# Altium project Thermostat_8CH.PrjPCB (part 6 of 6)

## Sheet TH8_EEM_connector.SchDoc: Stabilizer
size 420 x 297 mm; Author: G.Kasprowicz; CompanyName: WUT ISE; DrawnBy: G.Kasprowicz; Organization: WUT ISE; Address1: PW ISE; Address2: Nowowiejska 15/19 00-665 Warsaw; Address3: gkasprow@gmail.com; DocumentNumber: 7; Revision: 1.0; SheetNumber: 7; SheetTotal: 9; ModifiedBy: -; CheckedDate: -; Title2: EEM connector & drivers; DivGrp: WUT ISE; Designer: G.Kasprowicz; ModifiedDate: -; ProjectName: Sensor Box
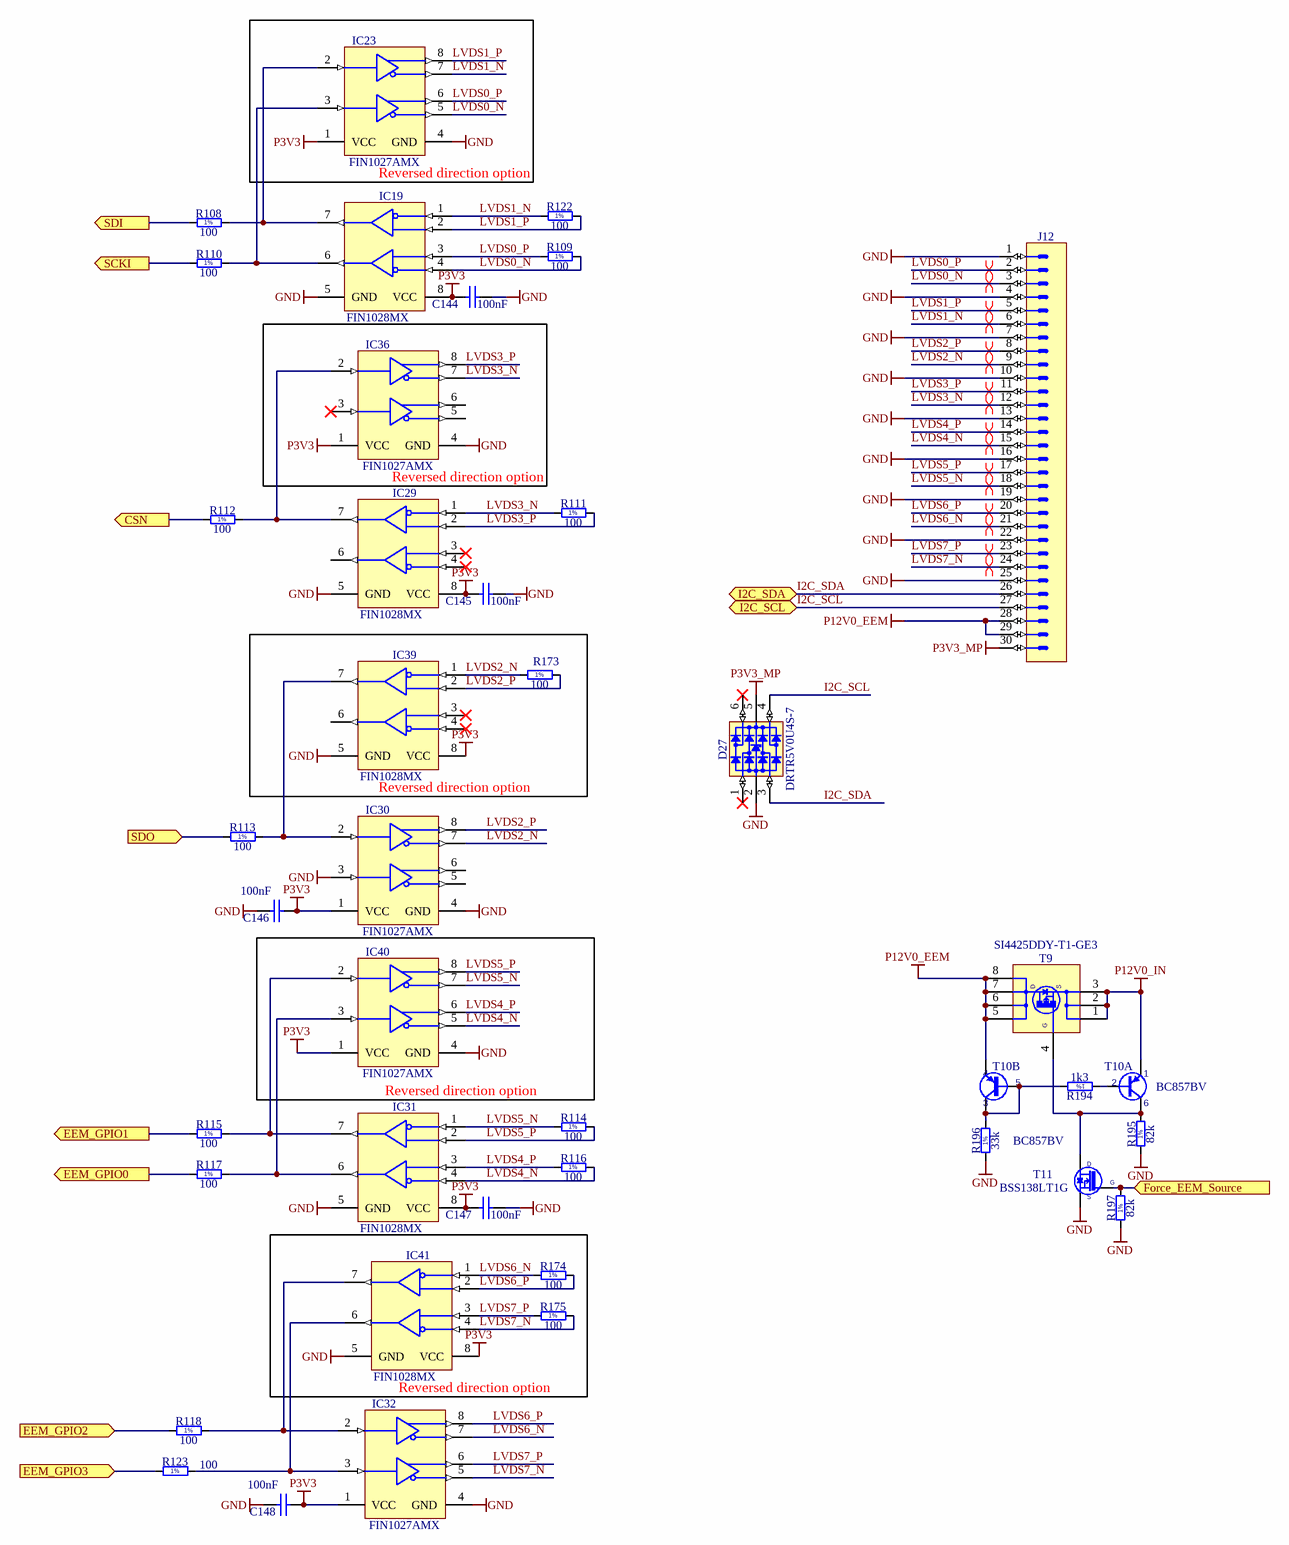
[diagram p7: TH8_EEM_connector.SchDoc]

### Parts
C144  100nF  [CAPC1005X55N]
C145  100nF  [CAPC1005X55N]
C146  100nF  [CAPC1005X55N]
C147  100nF  [CAPC1005X55N]
C148  100nF  [CAPC1005X55N]
D27  DRTR5V0U4S-7  [SOT65P210X110-6N]
IC19  FIN1028MX  [SOIC127P600X175-8N]
IC23  FIN1027AMX  [SOIC127P600X175-8N]
IC29  FIN1028MX  [SOIC127P600X175-8N]
IC30  FIN1027AMX  [SOIC127P600X175-8N]
IC31  FIN1028MX  [SOIC127P600X175-8N]
IC32  FIN1027AMX  [SOIC127P600X175-8N]
IC36  FIN1027AMX  [SOIC127P600X175-8N]
IC39  FIN1028MX  [SOIC127P600X175-8N]
IC40  FIN1027AMX  [SOIC127P600X175-8N]
IC41  FIN1028MX  [SOIC127P600X175-8N]
J12  (no value)  [3M_N2530-6002RB]
R108  100  [RESC1005X40N]
R109  100  [RESC1005X40N]
R110  100  [RESC1005X40N]
R111  100  [RESC1005X40N]
R112  100  [RESC1005X40N]
R113  100  [RESC1005X40N]
R114  100  [RESC1005X40N]
R115  100  [RESC1005X40N]
R116  100  [RESC1005X40N]
R117  100  [RESC1005X40N]
R118  100  [RESC1005X40N]
R122  100  [RESC1005X40N]
R123  100  [RESC1005X40N]
R173  100  [RESC1005X40N]
R174  100  [RESC1005X40N]
R175  100  [RESC1005X40N]
R194  1k3  [RESC1608X55N]
R195  82k  [RESC1608X55N]
R196  33k  [RESC1005X40N]
R197  82k  [RESC1608X55N]
T9  SI4425DDY-T1-GE3  [SOIC127P600X175-8N]
T10  BC857BV  [SOTFL50P160X60-6N]  (parts A,B of 2)
T11  BSS138LT1G  [SOT95P240X110-3N]

### Blocks framed on the sheet
Reversed direction option: IC23
Reversed direction option: IC36
Reversed direction option: IC39 R173
Reversed direction option: IC40
Reversed direction option: IC41 R174 R175

### Ports
CSN (out), EEM_GPIO0 (out), EEM_GPIO1 (out), EEM_GPIO2 (in), EEM_GPIO3 (in), Force_EEM_Source (in), I2C_SCL (bidir), I2C_SDA (bidir), SCKI (out), SDI (out), SDO (in)

### Nets
GND: C144.1 C145.1 C146.1 C147.1 C148.1 D27.2(GND) IC19.5(GND) IC23.4(GND) IC29.5(GND) IC30.3(DIN2RIN-) IC30.4(GND) IC31.5(GND) IC32.4(GND) IC36.4(GND) IC39.5(GND) IC40.4(GND) IC41.5(GND) J12.1 J12.4 J12.7 J12.10 J12.13 J12.16 J12.19 J12.22 J12.25 R195.1 R196.1 R197.1 T11.2(S)
P3V3: C144.2 C145.2 C146.2 C147.2 C148.2 IC19.8(VCC) IC23.1(VCC) IC29.8(VCC) IC30.1(VCC) IC31.8(VCC) IC32.1(VCC) IC36.1(VCC) IC39.8(VCC) IC40.1(VCC) IC41.8(VCC)
P3V3_MP: D27.5(VBUS) J12.30
P12V0_EEM: J12.28 J12.29 T9.5(D) T9.6(D) T9.7(D) T9.8(D) T10.4(E)
P12V0_IN: T9.1(S) T9.2(S) T9.3(S) T10.1(E)
I2C_SCL: D27.4(I/O3) J12.27 ; port I2C_SCL
I2C_SDA: D27.3(I/O2) J12.26 ; port I2C_SDA
LVDS0_N: IC19.4(RIN2-) IC23.5(DOUT-) J12.3 R109.2
LVDS0_P: IC19.3(RIN2+) IC23.6(DOUT+) J12.2 R109.1
LVDS1_N: IC19.1(RIN1-) IC23.7(DOUT-) J12.6 R122.1
LVDS1_P: IC19.2(RIN1+) IC23.8(DOUT+) J12.5 R122.2
LVDS2_N: IC30.7(DOUT-) IC39.1(RIN1-) J12.9 R173.1
LVDS2_P: IC30.8(DOUT+) IC39.2(RIN1+) J12.8 R173.2
LVDS3_N: IC29.1(RIN1-) IC36.7(DOUT-) J12.12 R111.1
LVDS3_P: IC29.2(RIN1+) IC36.8(DOUT+) J12.11 R111.2
LVDS4_N: IC31.4(RIN2-) IC40.5(DOUT-) J12.15 R116.2
LVDS4_P: IC31.3(RIN2+) IC40.6(DOUT+) J12.14 R116.1
LVDS5_N: IC31.1(RIN1-) IC40.7(DOUT-) J12.18 R114.1
LVDS5_P: IC31.2(RIN1+) IC40.8(DOUT+) J12.17 R114.2
LVDS6_N: IC32.7(DOUT-) IC41.1(RIN1-) J12.21 R174.1
LVDS6_P: IC32.8(DOUT+) IC41.2(RIN1+) J12.20 R174.2
LVDS7_N: IC32.5(DOUT-) IC41.4(RIN2-) J12.24 R175.2
LVDS7_P: IC32.6(DOUT+) IC41.3(RIN2+) J12.23 R175.1
NetIC9_73: R112.1 ; port CSN
NetIC9_75: R113.1 ; port SDO
NetIC9_76: R108.1 ; port SDI
NetIC9_114: R197.2 T11.1(G) ; port Force_EEM_Source
NetIC9_117: R110.1 ; port SCKI
NetIC9_118: R117.1 ; port EEM_GPIO0
NetIC9_119: R115.1 ; port EEM_GPIO1
NetIC9_122: R118.1 ; port EEM_GPIO2
NetIC9_123: R123.1 ; port EEM_GPIO3
NetIC19_6: IC19.6(ROUT2) IC23.3(DIN2RIN-) R110.2
NetIC19_7: IC19.7(ROUT1) IC23.2(DIN1) R108.2
NetIC29_7: IC29.7(ROUT1) IC36.2(DIN1) R112.2
NetIC30_2: IC30.2(DIN1) IC39.7(ROUT1) R113.2
NetIC31_6: IC31.6(ROUT2) IC40.3(DIN2RIN-) R117.2
NetIC31_7: IC31.7(ROUT1) IC40.2(DIN1) R115.2
NetIC32_2: IC32.2(DIN1) IC41.7(ROUT1) R118.2
NetIC32_3: IC32.3(DIN2RIN-) IC41.6(ROUT2) R123.2
NetR194_1: R194.1 T10.2(B)
NetR194_2: R194.2 R196.2 T10.3(C) T10.5(B)
NetR195_2: R195.2 T9.4(S) T10.6(C) T11.3(D)

Not connected (* = marked no-connect by the designer): D27 1(I/O1)* 6(I/O4)*; IC29 3(RIN2+)* 4(RIN2-)* 6(ROUT2); IC30 5(DOUT-) 6(DOUT+); IC36 3(DIN2RIN-)* 5(DOUT-) 6(DOUT+); IC39 3(RIN2+)* 4(RIN2-)* 6(ROUT2)

### Layout directives
differential pair: LVDS0_N, LVDS0_P, LVDS1_N, LVDS1_P, LVDS2_N, LVDS2_P, LVDS3_N, LVDS3_P, LVDS4_N, LVDS4_P, LVDS5_N, LVDS5_P, LVDS6_N, LVDS6_P, LVDS7_N, LVDS7_P

### Notes on the sheet
- Project/Equipment
- Document
- Designer
- Drawn by
- Check.by
- Copyright WUT ISE 2020.
  This documentation describes Open Hardware and is licensed under the CERN OHL v.1.2. You may redistribute and modify this documentation under the terms of the CERN OHL v.1.2. (http://ohwr.org/CERNOHL). This documentation is distributed WITHOUT ANY EXPRESS OR IMPLIED WARRANTY, INCLUDING OF MERCHANTABILITY, SATISFACTORY QUALITY AND FITNESS FOR A PARTICULAR PURPOSE. Please see the CERN OHL v.1.2 for applicable conditions.
- Contact
- File
- Last Mod.
- Print Date
- Sheet
- Size
- A3
- of
- Rev
- (in symbol R0402_33K_1%_0.0625W_100PPM) 1%
- (in symbol R0402_100R_1%_0.0625W_100PPM) 1%
- (in symbol R0603_1K3_1%_0.1W_100PPM) 1%
- (in symbol R0603_82K_1%_0.1W_100PPM) 1%
- (in symbol SI4425DDY-T1-GE3) G

### Library data of the parts
C144-C148 = CC0402_100NF_16V_10%_X5R: as C79-C81 on sheet TH8_RMII_Ethernet; Part Number: CC0402_100NF_16V_10%_X5R; Component Kind: Standard; Component Type: Standard; Pin Count: 2; Value: 100nF; Status: None; Manufacturer Part Number: CC0402_100NF_16V_10%_X5R; Case: 0402; Mounted: Yes; Socket: No; SMD: Yes; Sense: No; Manufacturer1 Example: MURATA; Manufacturer1 ComponentHeight: 0.55mm; HelpURL: \\cern.ch\dfs\Applications\Altium\Datasheets\CC0402_X5R_MURATA_GRM.pdf; Author: CERN DEM JLC; CreateDate: 10.12.2013; LatestRevisionDate: 10.12.2013
D27 = D_TVS_DRTR5V0U4S-7: Integrated Quad Ultra-Low Capacitance ESD Protection; Part Description: Integrated Quad Ultra-Low Capacitance ESD (±8kV) Protection; Manufacturer: DIODES; PressFit: No; Bonding: No; Status Comment: Active; Part Number: DRTR5V0U4S-7; Component Kind: Standard; Component Type: Standard; Device: DRTR5V0U4S-7; PackageDescription: SOT363, SC70-6, 0.65mm Pitch; 6 Pin, 1.25mm W X 2.00mm L X 1.10mm H body, IPC Medium Density; Status: Active; Manufacturer Part Number: DRTR5V0U4S-7; Pin Count: 6; Case: SOT363; Mounted: Yes; Socket: No; SMD: Yes; Sense: No; ComponentHeight: 1.1mm; HelpURL: \\cern.ch\dfs\Applications\Altium\Datasheets\PRTR5V0U4Y.pdf; Author: GK; CreateDate: 24.01.2017; LatestRevisionDate: 14.09.2020
IC19 IC29 IC31 IC39 IC41 = IFC_FIN1028: 3.3V LVDS 2-Bit High-Speed Differential Reciever; Manufacturer: ON Semiconductor; PressFit: No; Bonding: No; Part Number: FIN1028MX; Component Kind: Standard; Component Type: Standard; Device: FIN1028MX; PackageDescription: SOIC 8, Pitch 1.27mm - Body 4x5mm, IPC Medium Density; Part Description: 3.3V LVDS 2-Bit High-Speed Differential Reciever; Manufacturer Part Number: FIN1028MX; Pin Count: 8; Case: SOIC8; Mounted: Yes; Socket: No; SMD: Yes; Sense: No; ComponentHeight: 0.8mm; Author: GK; HelpURL: \\cern.ch\dfs\Applications\Altium\Datasheets\FIN1101K8X.pdf; CreateDate: 08/11/2016; LatestRevisionDate: 08/11/2016
IC23 IC30 IC32 IC36 IC40 = IFC_FIN1027A: 3.3V LVDS, 2-Bit, High-Speed, Differential Driver; Manufacturer: ON Semiconductor; PressFit: No; Bonding: No; Part Number: FIN1027AMX; Component Kind: Standard; Component Type: Standard; Device: FIN1027AMX; PackageDescription: SOIC 8, Pitch 1.27mm - Body 4x5mm, IPC Medium Density; Part Description: 3.3V LVDS, 2-Bit, High-Speed, Differential Driver; Manufacturer Part Number: FIN1027AMX; Pin Count: 8; Case: SOIC8; Mounted: Yes; Socket: No; SMD: Yes; Sense: No; ComponentHeight: 0.8mm; Author: GK; HelpURL: \\cern.ch\dfs\Applications\Altium\Datasheets\FIN1101K8X.pdf; CreateDate: 08/11/2016; LatestRevisionDate: 08/11/2016
J12 = 3M_N2530-6002RB: Connector 30 Male; Part Description: 30 Contacts - Straight .100'' x .100'' Low Profile Four-Wall Header, 2500 Series; Manufacturer: 3M; PressFit: No; Part Number: 3M_N2530-6002RB; Component Kind: Standard; Component Type: Standard; Pin Count: 30; Family: Header 30; Mounted: Yes; Socket: No; SMD: No; Sense: No; Status: None; Manufacturer Part Number: N2530-6002RB; ComponentHeight: 10.03mm; HelpURL: \\cern.ch\dfs\Applications\Altium\Datasheets\3M_N2530-6002RB.pdf; Author: CERN DEM JLC; CreateDate: 11.02.2009; LatestRevisionDate: 11.08.2009
R108-R118 R122 R123 R173-R175 = R0402_100R_1%_0.0625W_100PPM: Resistor - 1%; Part Description: General Purpose Thick Film Chip Resistor; Manufacturer: GENERIC; Manufacturer1 Part Number: 232270671001L; TC: ±100ppm/°C; PressFit: No; Part Number: R0402_100R_1%_0.0625W_100PPM; Component Kind: Standard; Component Type: Standard; Pin Count: 2; Value: 100; Status: Not Recommended; Power: 0.0625W; Tolerance: ±1%; Manufacturer Part Number: R0402_100R_1%_0.0625W_100PPM; Case: 0402; Mounted: Yes; Sense: No; Socket: No; SMD: Yes; Manufacturer1 Example: YAGEO PHYCOMP; Manufacturer1 ComponentHeight: 0.4mm; HelpURL: \\cern.ch\dfs\Applications\Altium\Datasheets\R0402_Phycomp_RC0402.pdf; Author: CERN DEM JLC; CreateDate: 03.12.2007; LatestRevisionDate: 17.10.2012
R194 = R0603_1K3_1%_0.1W_100PPM: Resistor - 1%; Part Description: General Purpose Thick Film Chip Resistor; Manufacturer: GENERIC; Manufacturer1 Part Number: NRC06F1301TRF; Power: 0.1W; TC: ±100ppm/°C; PressFit: No; Part Number: R0603_1K3_1%_0.1W_100PPM; Component Kind: Standard; Component Type: Standard; Pin Count: 2; Value: 1k3; Status: Preferred; Tolerance: ±1%; Manufacturer Part Number: R0603_1K3_1%_0.1W_100PPM; Case: 0603; Mounted: Yes; Sense: No; Socket: No; SMD: Yes; Manufacturer1 Example: NIC COMPONENT; Manufacturer1 ComponentHeight: 0.55mm; HelpURL: \\cern.ch\dfs\Applications\Altium\Datasheets\R0603_NIC_NRC.pdf; Author: CERN DEM JLC; CreateDate: 03.12.2007; LatestRevisionDate: 13.03.2008
R195 R197 = R0603_82K_1%_0.1W_100PPM: Resistor - 1%; Part Description: General Purpose Thick Film Chip Resistor; Manufacturer: GENERIC; Manufacturer1 Part Number: NRC06F8202TRF; Power: 0.1W; TC: ±100ppm/°C; Part Number: R0603_82K_1%_0.1W_100PPM; Component Kind: Standard; Component Type: Standard; Pin Count: 2; Value: 82k; Status: Preferred; Tolerance: ±1%; Manufacturer Part Number: R0603_82K_1%_0.1W_100PPM; Case: 0603; Mounted: Yes; Sense: No; Socket: No; SMD: Yes; Manufacturer1 Example: NIC COMPONENT; Manufacturer1 ComponentHeight: 0.55mm; HelpURL: \\cern.ch\dfs\Applications\Altium\Datasheets\R0603_NIC_NRC.pdf; Author: CERN DEM JLC; CreateDate: 03.12.2007; LatestRevisionDate: 13.03.2008
R196 = R0402_33K_1%_0.0625W_100PPM: Resistor - 1%; Part Description: General Purpose Thick Film Chip Resistor; Manufacturer: GENERIC; Manufacturer1 Part Number: 232270673303L; TC: ±100ppm/°C; PressFit: No; Part Number: R0402_33K_1%_0.0625W_100PPM; Component Kind: Standard; Component Type: Standard; Pin Count: 2; Value: 33k; Status: Not Recommended; Power: 0.0625W; Tolerance: ±1%; Manufacturer Part Number: R0402_33K_1%_0.0625W_100PPM; Case: 0402; Mounted: Yes; Sense: No; Socket: No; SMD: Yes; Manufacturer1 Example: YAGEO PHYCOMP; Manufacturer1 ComponentHeight: 0.4mm; HelpURL: \\cern.ch\dfs\Applications\Altium\Datasheets\R0402_Phycomp_RC0402.pdf; Author: CERN DEM JLC; CreateDate: 03.12.2007; LatestRevisionDate: 17.10.2012
T9 = SI4425DDY-T1-GE3: -30V -19.7A P-Channel MOSFET; Manufacturer: VISHAY SILICONIX; PressFit: No; Bonding: No; Part Number: SI4425DDY-T1-GE3; Component Kind: Standard; Component Type: Standard; Device: SI4425DDY-T1-GE3; PackageDescription: SOIC 8, Pitch 1.27mm - Body 4x5mm, IPC Medium Density; Part Description: -30V -19.7A P-Channel MOSFET; Manufacturer Part Number: SI4425DDY-T1-GE3; Pin Count: 8; Case: SOIC8; Mounted: Yes; Socket: No; SMD: Yes; Sense: No; ComponentHeight: 1.75mm; HelpURL: \\cern.ch\dfs\Applications\Altium\Datasheets\SI4425DDY-T1-GE3.pdf; Author: CERN DEM MR; CreateDate: 05/10/2016; LatestRevisionDate: 05/10/2016
T10 = BC857BV: 45V, 100mA PNP General Purpose Double Transistor; Part Description: -45V -100mA PNP General Purpose Double Transistor; Manufacturer: NXP SEMICONDUCTORS; PressFit: No; Bonding: No; Part Number: BC857BV; Component Kind: Standard; Component Type: Standard; Device: BC857BV; PackageDescription: SOTFL (SOT666), 0.50mm, Pitch; 6 Pin, 1.20mm W X 1.60mm L X 0.60mm H Body, IPC Medium Density; Manufacturer Part Number: BC857BV; Pin Count: 6; Case: SOT666; Mounted: Yes; Socket: No; SMD: Yes; Sense: No; ComponentHeight: 0.6mm; HelpURL: \\cern.ch\dfs\Applications\Altium\Datasheets\BC857BV.pdf; Author: CERN DEM JLC; CreateDate: 01/12/2011; LatestRevisionDate: 01/12/2011
T11 = BSS138LT1G: N-CHANNEL MOSFET WITH DIODE; Part Description: 50V 200mA N-Channel Enhancement Mode Field-Effect Transistor; Manufacturer: ON SEMICONDUCTOR; PressFit: No; Bonding: No; Part Number: BSS138LT1G; Component Kind: Standard; Component Type: Standard; Device: BSS138LT1G; PackageDescription: SOT23 3-Leads, Pitch 0.95mm - Body 1.4x3mm, IPC Medium Density; Manufacturer Part Number: BSS138LT1G; Pin Count: 3; Case: SOT23-3; Mounted: Yes; Socket: No; SMD: Yes; Sense: No; ComponentHeight: 1.11mm; HelpURL: \\cern.ch\dfs\Applications\Altium\Datasheets\BSS138LT1G.pdf; Author: CERN DEM JLC; CreateDate: 23.03.2009; LatestRevisionDate: 23.03.2009

## Sheet TH8_Breakout.SchDoc: Thermostat 8CH
size 420 x 297 mm; DocumentNumber: 6; SheetNumber: 6; SheetTotal: 9; ModifiedBy: -; CheckedDate: -; Title2: Breakout board; DivGrp: WUT ISE; Designer: G.Kasprowicz
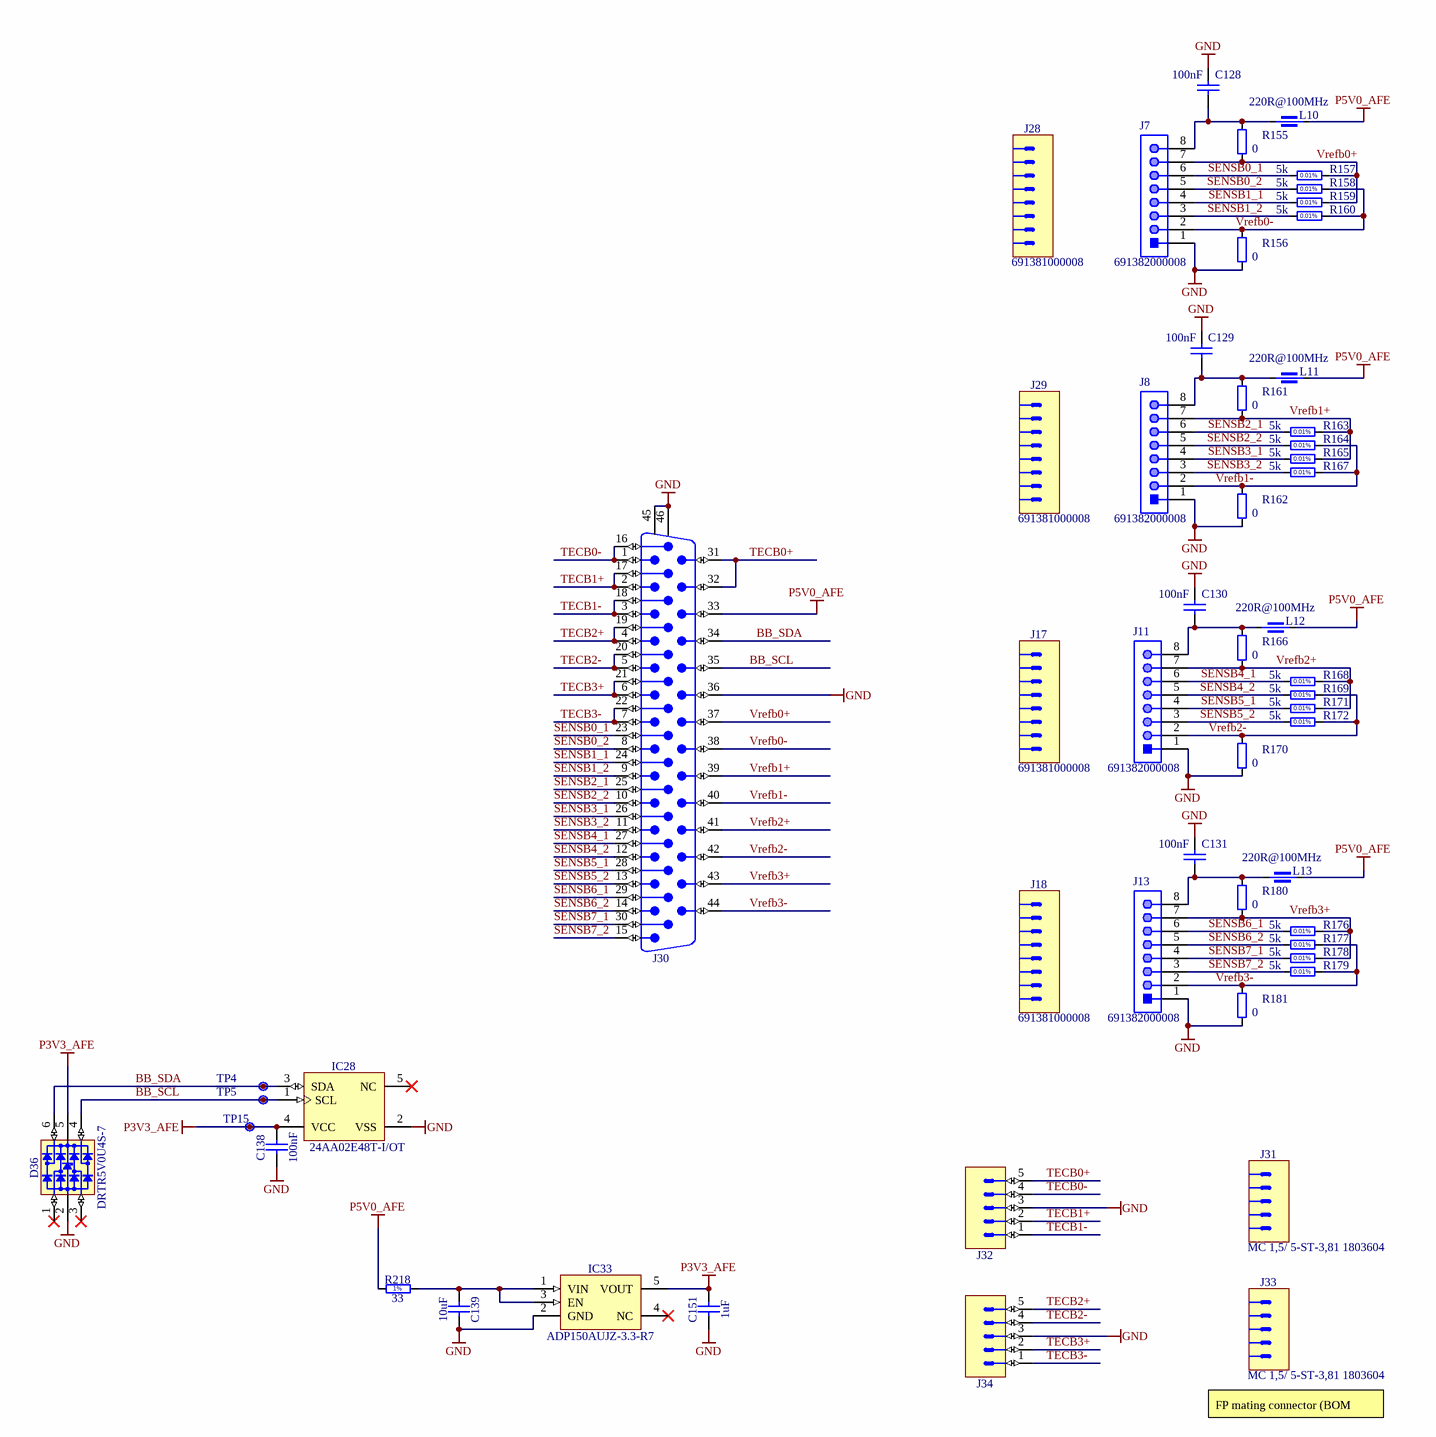
[diagram p8: TH8_Breakout.SchDoc]

### Parts
C128  100nF  [CAPC1005X55N]
C129  100nF  [CAPC1005X55N]
C130  100nF  [CAPC1005X55N]
C131  100nF  [CAPC1005X55N]
C138  100nF  [CAPC1005X55N]
C139  10uF  [CAPC2012X135N]
C151  1uF  [CAPC1608X87N]
D36  DRTR5V0U4S-7  [SOT65P210X110-6N]
IC28  24AA02E48T-I/OT  [SOT95P280X145-5N]
IC33  ADP150AUJZ-3.3-R7  [SOT95P280X90-5N]
J7  691382000008  [691382000008]
J8  691382000008  [691382000008]
J11  691382000008  [691382000008]
J13  691382000008  [691382000008]
J17  691381000008  [WURTH_691381000008]
J18  691381000008  [WURTH_691381000008]
J28  691381000008  [WURTH_691381000008]
J29  691381000008  [WURTH_691381000008]
J30  D-Sub  [AMPHENOL_10090926-P444XLF]  (value not drawn)
J31  Manufacturer Part Number: MC 1,5/ 5-ST-3,81 1803604  [PHOENIX_1803604]
J32  (no value)  [PHOENIX_1803455]
J33  Manufacturer Part Number: MC 1,5/ 5-ST-3,81 1803604  [PHOENIX_1803604]
J34  (no value)  [PHOENIX_1803455]
L10  220R@100MHz  [INDC1005X55N]
L11  220R@100MHz  [INDC1005X55N]
L12  220R@100MHz  [INDC1005X55N]
L13  220R@100MHz  [INDC1005X55N]
R155  0  [RESC1608X55N]
R156  0  [RESC1608X55N]
R157  5k  [RESC2013X64N]
R158  5k  [RESC2013X64N]
R159  5k  [RESC2013X64N]
R160  5k  [RESC2013X64N]
R161  0  [RESC1608X55N]
R162  0  [RESC1608X55N]
R163  5k  [RESC2013X64N]
R164  5k  [RESC2013X64N]
R165  5k  [RESC2013X64N]
R166  0  [RESC1608X55N]
R167  5k  [RESC2013X64N]
R168  5k  [RESC2013X64N]
R169  5k  [RESC2013X64N]
R170  0  [RESC1608X55N]
R171  5k  [RESC2013X64N]
R172  5k  [RESC2013X64N]
R176  5k  [RESC2013X64N]
R177  5k  [RESC2013X64N]
R178  5k  [RESC2013X64N]
R179  5k  [RESC2013X64N]
R180  0  [RESC1608X55N]
R181  0  [RESC1608X55N]
R218  33  [RESC1005X40N]
TP4  Test Point  [TPS127]  (value not drawn)
TP5  Test Point  [TPS127]  (value not drawn)
TP15  Test Point  [TPS127]  (value not drawn)

### Nets
GND: C128.1 C129.1 C130.1 C131.1 C138.1 C139.2 C151.1 D36.2(GND) IC28.2(VSS) IC33.2(GND) J7.1 J8.1 J11.1 J13.1 J30.36 J30.45 J30.46 J32.3 J34.3 R156.1 R162.1 R170.1 R181.1
P3V3_AFE: C138.2 C151.2 D36.5(VBUS) IC28.4(VCC) IC33.5(VOUT) TP15.1
P5V0_AFE: J30.33 L10.2 L11.2 L12.2 L13.2 R218.1
BB_SCL: D36.4(I/O3) IC28.1(SCL) J30.35 TP5.1
BB_SDA: D36.6(I/O4) IC28.3(SDA) J30.34 TP4.1
SENSB0_1: J7.6 J30.23 R157.1
SENSB0_2: J7.5 J30.8 R158.1
SENSB1_1: J7.4 J30.24 R159.1
SENSB1_2: J7.3 J30.9 R160.1
SENSB2_1: J8.6 J30.25 R163.1
SENSB2_2: J8.5 J30.10 R164.1
SENSB3_1: J8.4 J30.26 R165.1
SENSB3_2: J8.3 J30.11 R167.1
SENSB4_1: J11.6 J30.27 R168.1
SENSB4_2: J11.5 J30.12 R169.1
SENSB5_1: J11.4 J30.28 R171.1
SENSB5_2: J11.3 J30.13 R172.1
SENSB6_1: J13.6 J30.29 R176.1
SENSB6_2: J13.5 J30.14 R177.1
SENSB7_1: J13.4 J30.30 R178.1
SENSB7_2: J13.3 J30.15 R179.1
TECB0+: J30.31 J30.32 J32.5
TECB0-: J30.1 J30.16 J32.4
TECB1+: J30.2 J30.17 J32.2
TECB1-: J30.3 J30.18 J32.1
TECB2+: J30.4 J30.19 J34.5
TECB2-: J30.5 J30.20 J34.4
TECB3+: J30.6 J30.21 J34.2
TECB3-: J30.7 J30.22 J34.1
Vrefb0+: J7.7 J30.37 R155.1 R157.2 R159.2
Vrefb0-: J7.2 J30.38 R156.2 R158.2 R160.2
Vrefb1+: J8.7 J30.39 R161.1 R163.2 R165.2
Vrefb1-: J8.2 J30.40 R162.2 R164.2 R167.2
Vrefb2+: J11.7 J30.41 R166.1 R168.2 R171.2
Vrefb2-: J11.2 J30.42 R169.2 R170.2 R172.2
Vrefb3+: J13.7 J30.43 R176.2 R178.2 R180.1
Vrefb3-: J13.2 J30.44 R177.2 R179.2 R181.2
NetC128_2: C128.2 J7.8 L10.1 R155.2
NetC129_2: C129.2 J8.8 L11.1 R161.2
NetC130_2: C130.2 J11.8 L12.1 R166.2
NetC131_2: C131.2 J13.8 L13.1 R180.2
NetC139_1: C139.1 IC33.1(VIN) IC33.3(EN) R218.2

Not connected (* = marked no-connect by the designer): D36 1(I/O1)* 3(I/O2)*; IC28 5(NC)*; IC33 4(NC)*

### Notes on the sheet
- FP mating connector (BOM only)
- Project/Equipment
- Document
- Designer
- Drawn by
- Check.by
- Copyright WUT ISE 2020.
  This documentation describes Open Hardware and is licensed under the CERN OHL v.1.2. You may redistribute and modify this documentation under the terms of the CERN OHL v.1.2. (http://ohwr.org/CERNOHL). This documentation is distributed WITHOUT ANY EXPRESS OR IMPLIED WARRANTY, INCLUDING OF MERCHANTABILITY, SATISFACTORY QUALITY AND FITNESS FOR A PARTICULAR PURPOSE. Please see the CERN OHL v.1.2 for applicable conditions.
- Contact
- File
- Last Mod.
- Print Date
- Sheet
- Size
- A3
- of
- Rev
- (in symbol R0402_33R_1%_0.0625W_100PPM) 1%
- (in symbol R0805_5K_0.01%_0.2W_0.2PPM_VISHAY_VSMP) 0.01%

### Library data of the parts
C128-C131 C138 = CC0402_100NF_16V_10%_X5R: as C79-C81 on sheet TH8_RMII_Ethernet; Part Number: CC0402_100NF_16V_10%_X5R; Component Kind: Standard; Component Type: Standard; Pin Count: 2; Value: 100nF; Status: None; Manufacturer Part Number: CC0402_100NF_16V_10%_X5R; Case: 0402; Mounted: Yes; Socket: No; SMD: Yes; Sense: No; Manufacturer1 Example: MURATA; Manufacturer1 ComponentHeight: 0.55mm; HelpURL: \\cern.ch\dfs\Applications\Altium\Datasheets\CC0402_X5R_MURATA_GRM.pdf; Author: CERN DEM JLC; CreateDate: 10.12.2013; LatestRevisionDate: 10.12.2013
C139 = CC0805_10UF_16V_10%_X5R: Non-polarised capacitor; Part Description: SMD Multilayer Chip Ceramic Capacitor; Manufacturer: GENERIC; Manufacturer1 Part Number: C0805C106K4PAC; Voltage: 16V; TC: X5R; Tolerance: ±10%; Part Number: CC0805_10UF_16V_10%_X5R; Component Kind: Standard; Component Type: Standard; Pin Count: 2; Value: 10uF; Status: Preferred; Manufacturer Part Number: CC0805_10UF_16V_10%_X5R; Case: 0805; Mounted: Yes; Socket: No; SMD: Yes; Manufacturer1 Example: KEMET; Manufacturer1 ComponentHeight: 1.4mm; HelpURL: \\cern.ch\dfs\Applications\Altium\Datasheets\CC1206_X5R_KEMET.pdf; Author: CERN DEM JLC; CreateDate: 03.12.2007; LatestRevisionDate: 03.12.2007; Sense: No
C151 = CC0603_1UF_25V_10%_X7R: Non-polarised capacitor; Part Description: SMD Multilayer Chip Ceramic Capacitor; Manufacturer: GENERIC; Manufacturer1 Part Number: GRM188R71E105KA12D; Voltage: 25V; TC: X7R; Tolerance: ±10%; Part Number: CC0603_1UF_25V_10%_X7R; Component Kind: Standard; Component Type: Standard; Pin Count: 2; Value: 1uF; Status: None; Manufacturer Part Number: CC0603_1UF_25V_10%_X7R; Case: 0603; Mounted: Yes; Socket: No; SMD: Yes; Sense: No; Manufacturer1 Example: MURATA; Manufacturer1 ComponentHeight: 0.9mm; HelpURL: \\cern.ch\dfs\Applications\Altium\Datasheets\CC0603_X7R_MURATA.pdf; Author: CERN DEM JLC; CreateDate: 18/01/2011; LatestRevisionDate: 18/01/2011
D36 = D_TVS_DRTR5V0U4S-7: as D27 on sheet TH8_EEM_connector; Part Number: DRTR5V0U4S-7; Component Kind: Standard; Component Type: Standard; Device: DRTR5V0U4S-7; PackageDescription: SOT363, SC70-6, 0.65mm Pitch; 6 Pin, 1.25mm W X 2.00mm L X 1.10mm H body, IPC Medium Density; Status: Active; Manufacturer Part Number: DRTR5V0U4S-7; Pin Count: 6; Case: SOT363; Mounted: Yes; Socket: No; SMD: Yes; Sense: No; ComponentHeight: 1.1mm; HelpURL: \\cern.ch\dfs\Applications\Altium\Datasheets\PRTR5V0U4Y.pdf; Author: GK; CreateDate: 24.01.2017; LatestRevisionDate: 14.09.2020
IC28 = 24AA02E48T-I/OT: 1.7V-5.5V, 2K I2C Serial EEPROM With EUI-48 Node Identity; Manufacturer: MICROCHIP TECHNOLOGY; PressFit: No; Bonding: No; Part Number: 24AA02E48T-I/OT; Component Kind: Standard; Component Type: Standard; Device: 24AA02E48T-I/OT; PackageDescription: SOT, 0.95mm pitch; 5 pin, 1.60mm W X 2.90mm L X 1.45mm H body, IPC Medium Density; Part Description: 1.7V-5.5V, 2K I2C Serial EEPROM With EUI-48 Node Identity; Manufacturer Part Number: 24AA02E48T-I/OT; Pin Count: 5; Case: SOT23-5; Mounted: Yes; Socket: No; SMD: Yes; Sense: No; ComponentHeight: 1.45mm; HelpURL: \\cern.ch\dfs\Applications\Altium\Datasheets\24AA02E48T-I-OT.pdf; Author: CERN DEM MR; CreateDate: 31.03.2016; LatestRevisionDate: 31.03.2016
IC33 = ADP150AUJZ-3.3-R7: Ultralow Noise, 150 mA CMOS Linear Regulator; Part Description: 3.3V, 150mA, Ultralow Noise, CMOS Linear Regulator; Manufacturer: ANALOG DEVICES; PressFit: No; Bonding: No; Part Number: ADP150AUJZ-3.3-R7; Component Kind: Standard; Component Type: Standard; Device: ADP150AUJZ-3.3-R7; PackageDescription: SOT23, 0.95mm pitch; 5 pin, 1.75mm W X 3.00mm L, IPC Medium Density; Manufacturer Part Number: ADP150AUJZ-3.3-R7; Pin Count: 5; Case: SOT23; Mounted: Yes; Socket: No; SMD: Yes; Sense: No; ComponentHeight: 0.9mm; HelpURL: \\cern.ch\dfs\Applications\Altium\Datasheets\ADP150AUJZ-3.3-R7.pdf; Author: CERN DEM JLC; CreateDate: 27/09/2011; LatestRevisionDate: 19/06/2014
J7 J8 J11 J13 = 691382000008: WR-TBL Serie 382 Vertical PCB Header, Pluggable, pitch 2.5mm, 8p; Compliance: RoHS; Modularity: No; Pin Number: 8; Rated Current [UL]: 12A; Working Voltage [UL]: 300VAC; ComponentLink1Description: Manufacturer; ComponentLink1URL: http://www.we-online.de; ComponentLink2URL: https://katalog.we-online.de/em/datasheet/691382000008.pdf; ComponentLink2Description: Datasheet; Mounting Technology: THT; Part Number: 691382000008; Packaging: Box; Operating Temperature: -40 to +105degC; PCB/Cable/Panel: PCB; Pitch: 2.5mm; Published Date: October 2019; Type: Vertical; Publisher: Wurth Elektronik; Application: Pluggable
J17 J18 J28 J29 = CON_TB_WURTH_691381000008: Phoenix Contact 2.5 pitch terminal plug, 8 ways; Manufacturer: WURTH; Manufacturer Part Number: 691381000008
J30 = AMPHENOL_10090926-P444XLF: Connector D-sub 44 Male; Part Description: Right Angle High Density D-sub 44 Male Contacts with Harpoons + UNC 4-40 Clinchnuts + Electrical Continuity; PressFit: No; Part Number: AMPHENOL_10090926-P444XLF; Component Kind: Standard; Component Type: Standard; Pin Count: 46; Family: D-Sub; Mounted: Yes; Socket: No; SMD: No; Sense: No; Status: None; Manufacturer: AMPHENOL; Manufacturer Part Number: 10090926-P444XLF; ComponentHeight: 12.8mm; HelpURL: \\cern.ch\dfs\Applications\Altium\Datasheets\AMPHENOL_10090926-P444XLF.pdf; Author: CERN DEM BC; CreateDate: 22.10.2020; LatestRevisionDate: 22.10.2020
J31 J33 = PHOENIX_1803604: Phoenix Contact 3.81 pitch terminal plug, 5 ways; Mates with: PHOENIX_1803303; Manufacturer: Phoenix Contact
J32 J34 = PHOENIX_1803455: Connector 5 Male; Part Description: 8A 160 V, Pitch: 3.81mm, 5 Positions Header; Manufacturer: PHOENIX CONTACT; Manufacturer Part Number: 1803455 (MCV 1,5/ 5-G-3,81); PressFit: No; Part Number: PHOENIX_1803455; Component Kind: Standard; Component Type: Standard; Pin Count: 5; Mounted: Yes; Socket: No; SMD: No; Sense: No; Status: None; ComponentHeight: 9.2mm; HelpURL: \\cern.ch\dfs\Applications\Altium\Datasheets\PHOENIX_1803455.pdf; Author: CERN DEM JLC; CreateDate: 04.11.2013; LatestRevisionDate: 04.11.2013
L10-L13 = IND0402_MURATA_BLM15HB221SN1: Part Description: SMD EMIFIL Suppression Chip Ferrite Bead; Manufacturer: MURATA; Power: 250mA; Resistance: 1R; Tolerance: ±25%; Part Number: IND0402_MURATA_BLM15HB221SN1; Component Kind: Standard; Component Type: Standard; Pin Count: 2; Value: 220R@100MHz; Status: None; Manufacturer Part Number: BLM15HB221SN1; Case: 0402; Mounted: Yes; Socket: No; SMD: Yes; Sense: No; ComponentHeight: 0.55mm; HelpURL: \\cern.ch\dfs\Applications\Altium\Datasheets\IND0402_MURATA_BLM15H.pdf; Author: CERN DEM JLC; CreateDate: 23.06.2009; LatestRevisionDate: 25.10.2018
R155 R156 R161 R162 R166 R170 R180 R181 = R0603_0R_JUMPER: Resistor; Part Description: 1A (0.05R Max DC Resistance) Zero Ohm Jumper; Manufacturer: GENERIC; Manufacturer1 Part Number: NRC06Z0; PressFit: No; Part Number: R0603_0R_JUMPER; Component Kind: Standard; Component Type: Standard; Pin Count: 2; Value: 0; Status: Preferred; Manufacturer Part Number: R0603_0R_JUMPER; Case: 0603; Mounted: Yes; Sense: No; Socket: No; SMD: Yes; Manufacturer1 Example: NIC COMPONENT; Manufacturer1 ComponentHeight: 0.55mm; HelpURL: \\cern.ch\dfs\Applications\Altium\Datasheets\R0603_NIC_NRC.pdf; Author: CERN DEM JLC; CreateDate: 03.12.2007; LatestRevisionDate: 13.03.2008
R157-R160 R163-R165 R167-R169 R171 R172 R176-R179 = R0805_5K_0.01%_0.2W_0.2PPM_VISHAY_VSMP: Resistor - 0.01%; Part Description: Ultra High Precision Foil Wraparound Surface Mount Chip Resistor; Manufacturer: VISHAY PRECISION; Manufacturer Part Number: Y16245K00000T9R; Power: 0.2W; TC: ±0.2ppm/°C; PressFit: No; Part Number: R0805_5K_0.01%_0.2W_0.2PPM_VISHAY_VSMP; Component Kind: Standard; Component Type: Standard; Pin Count: 2; Value: 5k; Status: None; Tolerance: ±0.01%; Case: 0805; Mounted: Yes; Sense: No; Socket: No; SMD: Yes; Manufacturer1 ComponentHeight: 0.64mm; HelpURL: \\cern.ch\dfs\Applications\Altium\Datasheets\R0805_VISHAY_VSMP.pdf; Author: CERN DEM JLC; CreateDate: 22.09.2011; LatestRevisionDate: 22.09.2011
R218 = R0402_33R_1%_0.0625W_100PPM: Resistor - 1%; Part Description: General Purpose Thick Film Chip Resistor; Manufacturer: GENERIC; Manufacturer1 Part Number: 232270673309L; TC: ±100ppm/°C; PressFit: No; Part Number: R0402_33R_1%_0.0625W_100PPM; Component Kind: Standard; Component Type: Standard; Pin Count: 2; Value: 33; Status: Not Recommended; Power: 0.0625W; Tolerance: ±1%; Manufacturer Part Number: R0402_33R_1%_0.0625W_100PPM; Case: 0402; Mounted: Yes; Sense: No; Socket: No; SMD: Yes; Manufacturer1 Example: YAGEO PHYCOMP; Manufacturer1 ComponentHeight: 0.4mm; HelpURL: \\cern.ch\dfs\Applications\Altium\Datasheets\R0402_Phycomp_RC0402.pdf; Author: CERN DEM JLC; CreateDate: 03/12/2007; LatestRevisionDate: 17/10/2012
TP4 TP5 TP15 = SMD_PAD_1.27X1.27MM: as TP6-TP11 on sheet TH8_Supply; Part Number: SMD_PAD_1.27X1.27MM; Component Kind: Standard (No BOM); Component Type: Standard (No BOM); Pin Count: 1; Family: Test Point; Socket: No; SMD: Yes; Sense: No; Status: None; ComponentHeight: 0mm; HelpURL: Undefined; Author: CERN DEM JLC; CreateDate: 12.01.2008; LatestRevisionDate: 12.01.2008; PackageDescription: 1.27mm x 1.27mm PCB Copper Area (SMD Test Point)

## Nets that join several sheets
GND: Thermostat_8CH (15 pins), TH8_CPU_STM32F4 (56 pins), U_AFE0 (35 pins), U_TEC_driver0 (37 pins), U_TEC_driver1 (37 pins), TH8_RMII_Ethernet (24 pins), TH8_USB (11 pins), U_AFE1 (35 pins), U_AFE2 (35 pins), U_AFE3 (35 pins), U_TEC_driver2 (37 pins), U_TEC_driver3 (37 pins), TH8_Supply (97 pins), TH8_EEM_connector (30 pins), TH8_Breakout (23 pins)
P3V0REF: TH8_CPU_STM32F4 (R70.2), U_TEC_driver0 (C26_1.1 IC5_1.2), U_TEC_driver1 (C26_2.1 IC5_2.2), U_TEC_driver2 (C26_3.1 IC5_3.2), U_TEC_driver3 (C26_4.1 IC5_4.2), TH8_Supply (5 pins)
P3V3: Thermostat_8CH (5 pins), TH8_CPU_STM32F4 (38 pins), TH8_RMII_Ethernet (8 pins), TH8_Supply (13 pins), TH8_EEM_connector (15 pins)
P3V3_MP: Thermostat_8CH (5 pins), TH8_Supply (D2.1 R10.1), TH8_EEM_connector (D27.5 J12.30)
P3V3IO: U_AFE0 (R38_1.2), U_AFE1 (R38_2.2), U_AFE2 (R38_3.2), U_AFE3 (R38_4.2), TH8_Supply (C115.2 IC12.5)
P5V0: TH8_CPU_STM32F4 (R82.1), U_TEC_driver0 (15 pins), U_TEC_driver1 (15 pins), U_TEC_driver2 (15 pins), U_TEC_driver3 (15 pins), TH8_Supply (44 pins)
P5V0A: Thermostat_8CH (J2.33 R1.2 R2.2), U_AFE0 (8 pins), U_TEC_driver0 (R71_1.2), U_TEC_driver1 (R71_2.2), U_AFE1 (8 pins), U_AFE2 (8 pins), U_AFE3 (8 pins), U_TEC_driver2 (R71_3.2), U_TEC_driver3 (R71_4.2), TH8_Supply (6 pins)
P12V0: TH8_CPU_STM32F4 (R83.2), TH8_Supply (45 pins)
P12V0_IN: TH8_Supply (11 pins), TH8_EEM_connector (T9.1 T9.2 T9.3 T10.1)
~{SHDN}0: TH8_CPU_STM32F4 (IC9.89), U_TEC_driver0 (R120_1.2)
~{SHDN}1: TH8_CPU_STM32F4 (IC9.90), U_TEC_driver1 (R120_2.2)
~{SHDN}2: TH8_CPU_STM32F4 (IC9.91), U_TEC_driver2 (R120_3.2)
~{SHDN}3: TH8_CPU_STM32F4 (IC9.92), U_TEC_driver3 (R120_4.2)
ADC_CLKIO: TH8_CPU_STM32F4 (IC9.100), U_AFE0 (IC7_1.10), U_AFE1 (IC7_2.10), U_AFE2 (IC7_3.10), U_AFE3 (IC7_4.10)
ADC_CSn0: TH8_CPU_STM32F4 (IC9.141), U_AFE0 (B1_1.1 IC7_1.14)
ADC_CSn1: TH8_CPU_STM32F4 (IC9.142), U_AFE1 (B1_2.1 IC7_2.14)
ADC_CSn2: TH8_CPU_STM32F4 (IC9.2), U_AFE2 (B1_3.1 IC7_3.14)
ADC_CSn3: TH8_CPU_STM32F4 (IC9.3), U_AFE3 (B1_4.1 IC7_4.14)
ADC_DIN: TH8_CPU_STM32F4 (IC9.5), U_AFE0 (B3_1.1 IC7_1.12), U_AFE1 (B3_2.1 IC7_2.12), U_AFE2 (B3_3.1 IC7_3.12), U_AFE3 (B3_4.1 IC7_4.12)
ADC_DOUT/RDYn: TH8_CPU_STM32F4 (IC9.4 R226.1), U_AFE0 (B4_1.1 IC7_1.11), U_AFE1 (B4_2.1 IC7_2.11), U_AFE2 (B4_3.1 IC7_3.11), U_AFE3 (B4_4.1 IC7_4.11)
ADC_SCLK: TH8_CPU_STM32F4 (IC9.1), U_AFE0 (B2_1.1 IC7_1.13), U_AFE1 (B2_2.1 IC7_2.13), U_AFE2 (B2_3.1 IC7_3.13), U_AFE3 (B2_4.1 IC7_4.13)
ADC_SYNC: TH8_CPU_STM32F4 (IC9.70), U_AFE0 (IC7_1.15), U_AFE1 (IC7_2.15), U_AFE2 (IC7_3.15), U_AFE3 (IC7_4.15)
AFE_SCL: Thermostat_8CH (D3.3 J2.35), TH8_CPU_STM32F4 (B15.1 IC9.11 R61.1)
AFE_SDA: Thermostat_8CH (D3.4 J2.34), TH8_CPU_STM32F4 (B14.1 IC9.10 R53.1)
AT_EVENT: TH8_CPU_STM32F4 (IC9.58), TH8_Supply (IC6.4 R67.1)
CPU_RESETn: TH8_CPU_STM32F4 (D5.1 IC13.2), TH8_Supply (T6.1)
DAC_SCLK: TH8_CPU_STM32F4 (IC9.111), U_TEC_driver0 (B12_1.1 IC5_1.6), U_TEC_driver1 (B12_2.1 IC5_2.6), U_TEC_driver2 (B12_3.1 IC5_3.6), U_TEC_driver3 (B12_4.1 IC5_4.6)
DAC_SDIN: TH8_CPU_STM32F4 (IC9.113), U_TEC_driver0 (B11_1.1 IC5_1.7), U_TEC_driver1 (B11_2.1 IC5_2.7), U_TEC_driver2 (B11_3.1 IC5_3.7), U_TEC_driver3 (B11_4.1 IC5_4.7)
DAC_SYNCn0: TH8_CPU_STM32F4 (IC9.88), U_TEC_driver0 (B13_1.1 IC5_1.5)
DAC_SYNCn1: TH8_CPU_STM32F4 (IC9.87), U_TEC_driver1 (B13_2.1 IC5_2.5)
DAC_SYNCn2: TH8_CPU_STM32F4 (IC9.57), U_TEC_driver2 (B13_3.1 IC5_3.5)
DAC_SYNCn3: TH8_CPU_STM32F4 (IC9.56), U_TEC_driver3 (B13_4.1 IC5_4.5)
FAN_PWM: TH8_CPU_STM32F4 (IC9.97), TH8_Supply (C82.1)
Freq: TH8_CPU_STM32F4 (IC9.116), U_TEC_driver0 (IC38_1.3), U_TEC_driver1 (IC38_2.3), U_TEC_driver2 (IC38_3.3), U_TEC_driver3 (IC38_4.3)
I2C1_SCL: Thermostat_8CH (R3.1 T2.2), TH8_CPU_STM32F4 (IC9.139)
I2C1_SDA: Thermostat_8CH (R4.1 T1.2), TH8_CPU_STM32F4 (IC9.140)
I2C_SCL: Thermostat_8CH (IC1.2 IC2.1 T2.3 TP2.1), TH8_EEM_connector (D27.4 J12.27)
I2C_SDA: Thermostat_8CH (IC1.1 IC2.3 T1.3 TP1.1), TH8_EEM_connector (D27.3 J12.26)
I_meas_P12V0: TH8_CPU_STM32F4 (IC9.20), TH8_Supply (C89.1 R141.2)
ITEC0: TH8_CPU_STM32F4 (IC9.41), U_TEC_driver0 (R225_1.1)
ITEC1: TH8_CPU_STM32F4 (IC9.42), U_TEC_driver1 (R225_2.1)
ITEC2: TH8_CPU_STM32F4 (IC9.46), U_TEC_driver2 (R225_3.1)
ITEC3: TH8_CPU_STM32F4 (IC9.47), U_TEC_driver3 (R225_4.1)
NetIC9_73: TH8_CPU_STM32F4 (IC9.73), TH8_EEM_connector (R112.1)
NetIC9_75: TH8_CPU_STM32F4 (IC9.75), TH8_EEM_connector (R113.1)
NetIC9_76: TH8_CPU_STM32F4 (IC9.76), TH8_EEM_connector (R108.1)
NetIC9_114: TH8_CPU_STM32F4 (IC9.114), TH8_EEM_connector (R197.2 T11.1)
NetIC9_117: TH8_CPU_STM32F4 (IC9.117), TH8_EEM_connector (R110.1)
NetIC9_118: TH8_CPU_STM32F4 (IC9.118), TH8_EEM_connector (R117.1)
NetIC9_119: TH8_CPU_STM32F4 (IC9.119), TH8_EEM_connector (R115.1)
NetIC9_122: TH8_CPU_STM32F4 (IC9.122), TH8_EEM_connector (R118.1)
NetIC9_123: TH8_CPU_STM32F4 (IC9.123), TH8_EEM_connector (R123.1)
NRST: TH8_CPU_STM32F4 (IC9.129), TH8_RMII_Ethernet (IC11.15 R125.2)
OVERTHERMn: Thermostat_8CH (IC1.3 R5.2 R6.2), TH8_CPU_STM32F4 (IC9.127), U_TEC_driver0 (D1_1.1), U_TEC_driver1 (D1_2.1), U_TEC_driver2 (D1_3.1), U_TEC_driver3 (D1_4.1)
POE_PWR_SRC: TH8_CPU_STM32F4 (IC9.12), TH8_Supply (R30.1 R31.2)
POE_VC+: TH8_RMII_Ethernet (D7.1 D10.1 D11.1 D22.1), TH8_Supply (L1.1 R14.2)
POE_VC-: TH8_RMII_Ethernet (D6.2 D8.2 D9.2 D23.2), TH8_Supply (R35.1 R64.1 R66.1 T4.2)
PWM_maxINeg0: TH8_CPU_STM32F4 (IC9.96), U_TEC_driver0 (B5_1.1 R55_1.1)
PWM_maxINeg1: TH8_CPU_STM32F4 (IC9.135), U_TEC_driver1 (B5_2.1 R55_2.1)
PWM_maxINeg2: TH8_CPU_STM32F4 (IC9.98), U_TEC_driver2 (B5_3.1 R55_3.1)
PWM_maxINeg3: TH8_CPU_STM32F4 (IC9.99), U_TEC_driver3 (B5_4.1 R55_4.1)
PWM_maxIPos0: TH8_CPU_STM32F4 (IC9.81), U_TEC_driver0 (B6_1.1 R57_1.1)
PWM_maxIPos1: TH8_CPU_STM32F4 (IC9.82), U_TEC_driver1 (B6_2.1 R57_2.1)
PWM_maxIPos2: TH8_CPU_STM32F4 (IC9.85), U_TEC_driver2 (B6_3.1 R57_3.1)
PWM_maxIPos3: TH8_CPU_STM32F4 (IC9.86), U_TEC_driver3 (B6_4.1 R57_4.1)
PWM_maxV0: TH8_CPU_STM32F4 (IC9.60), U_TEC_driver0 (B7_1.1 R59_1.1)
PWM_maxV1: TH8_CPU_STM32F4 (IC9.64), U_TEC_driver1 (B7_2.1 R59_2.1)
PWM_maxV2: TH8_CPU_STM32F4 (IC9.66), U_TEC_driver2 (B7_3.1 R59_3.1)
PWM_maxV3: TH8_CPU_STM32F4 (IC9.67), U_TEC_driver3 (B7_4.1 R59_4.1)
RMII_CRS_DV: TH8_CPU_STM32F4 (IC9.43), TH8_RMII_Ethernet (R27.1)
RMII_MDC: TH8_CPU_STM32F4 (IC9.27), TH8_RMII_Ethernet (B16.1 IC11.13)
RMII_MDIO: TH8_CPU_STM32F4 (IC9.36), TH8_RMII_Ethernet (B17.1 IC11.12 R98.2)
RMII_REF_CLK: TH8_CPU_STM32F4 (IC9.35), TH8_RMII_Ethernet (R29.1)
RMII_RXD0: TH8_CPU_STM32F4 (IC9.44), TH8_RMII_Ethernet (R23.1)
RMII_RXD1: TH8_CPU_STM32F4 (IC9.45), TH8_RMII_Ethernet (R24.1)
RMII_TX_EN: TH8_CPU_STM32F4 (IC9.126), TH8_RMII_Ethernet (IC11.16)
RMII_TXD0: TH8_CPU_STM32F4 (IC9.128), TH8_RMII_Ethernet (IC11.17)
RMII_TXD1: TH8_CPU_STM32F4 (IC9.74), TH8_RMII_Ethernet (IC11.18)
SENS0_1: Thermostat_8CH (J2.23), U_AFE0 (R40_1.1 R91_1.1)
SENS0_2: Thermostat_8CH (J2.8), U_AFE0 (R42_1.1 R44_1.1)
SENS0_N: Thermostat_8CH (J2.10), U_AFE1 (R42_2.1 R44_2.1)
SENS0_N: Thermostat_8CH (J2.12), U_AFE2 (R42_3.1 R44_3.1)
SENS0_N: Thermostat_8CH (J2.14), U_AFE3 (R42_4.1 R44_4.1)
SENS0_P: Thermostat_8CH (J2.25), U_AFE1 (R40_2.1 R91_2.1)
SENS0_P: Thermostat_8CH (J2.27), U_AFE2 (R40_3.1 R91_3.1)
SENS0_P: Thermostat_8CH (J2.29), U_AFE3 (R40_4.1 R91_4.1)
SENS1_1: Thermostat_8CH (J2.24), U_AFE0 (R46_1.1 R50_1.1)
SENS1_2: Thermostat_8CH (J2.9), U_AFE0 (R48_1.1 R132_1.1)
SENS1_N: Thermostat_8CH (J2.11), U_AFE1 (R48_2.1 R132_2.1)
SENS1_N: Thermostat_8CH (J2.13), U_AFE2 (R48_3.1 R132_3.1)
SENS1_N: Thermostat_8CH (J2.15), U_AFE3 (R48_4.1 R132_4.1)
SENS1_P: Thermostat_8CH (J2.26), U_AFE1 (R46_2.1 R50_2.1)
SENS1_P: Thermostat_8CH (J2.28), U_AFE2 (R46_3.1 R50_3.1)
SENS1_P: Thermostat_8CH (J2.30), U_AFE3 (R46_4.1 R50_4.1)
TACHO: TH8_CPU_STM32F4 (IC9.69), TH8_Supply (R9.1)
TEC0+: Thermostat_8CH (J2.31 J2.32), U_TEC_driver0 (L3_1.4)
TEC0-: Thermostat_8CH (J2.1 J2.16), U_TEC_driver0 (L3_1.3)
TEC1+: Thermostat_8CH (J2.2 J2.17), U_TEC_driver1 (L3_2.4)
TEC1-: Thermostat_8CH (J2.3 J2.18), U_TEC_driver1 (L3_2.3)
TEC2+: Thermostat_8CH (J2.4 J2.19), U_TEC_driver2 (L3_3.4)
TEC2-: Thermostat_8CH (J2.5 J2.20), U_TEC_driver2 (L3_3.3)
TEC3+: Thermostat_8CH (J2.6 J2.21), U_TEC_driver3 (L3_4.4)
TEC3-: Thermostat_8CH (J2.7 J2.22), U_TEC_driver3 (L3_4.3)
TEC_U_meas0: TH8_CPU_STM32F4 (IC9.29), U_TEC_driver0 (B23_1.1 C83_1.2 R77_1.2)
TEC_U_meas1: TH8_CPU_STM32F4 (IC9.34), U_TEC_driver1 (B23_2.1 C83_2.2 R77_2.2)
TEC_U_meas2: TH8_CPU_STM32F4 (IC9.37), U_TEC_driver2 (B23_3.1 C83_3.2 R77_3.2)
TEC_U_meas3: TH8_CPU_STM32F4 (IC9.40), U_TEC_driver3 (B23_4.1 C83_4.2 R77_4.2)
USB_ID: TH8_CPU_STM32F4 (IC9.102), TH8_USB (C108.2 D21.1 FB2.1)
USB_N: TH8_CPU_STM32F4 (IC9.103), TH8_USB (D21.4 L9.2)
USB_P: TH8_CPU_STM32F4 (IC9.104), TH8_USB (D21.3 L9.3)
USB_VBUS: TH8_CPU_STM32F4 (R34.2), TH8_USB (R73.1 R75.1)
Vref0: TH8_CPU_STM32F4 (IC9.13), U_TEC_driver0 (IC10_1.3 IC10_1.4 R79_1.1 R80_1.1)
Vref1: TH8_CPU_STM32F4 (IC9.14), U_TEC_driver1 (IC10_2.3 IC10_2.4 R79_2.1 R80_2.1)
Vref2: TH8_CPU_STM32F4 (IC9.15), U_TEC_driver2 (IC10_3.3 IC10_3.4 R79_3.1 R80_3.1)
Vref3: TH8_CPU_STM32F4 (IC9.18), U_TEC_driver3 (IC10_4.3 IC10_4.4 R79_4.1 R80_4.1)
Vref+: Thermostat_8CH (J2.37), U_AFE0 (R50_1.2 R91_1.2 R129_1.1 R140_1.1)
Vref+: Thermostat_8CH (J2.39), U_AFE1 (R50_2.2 R91_2.2 R129_2.1 R140_2.1)
Vref+: Thermostat_8CH (J2.41), U_AFE2 (R50_3.2 R91_3.2 R129_3.1 R140_3.1)
Vref+: Thermostat_8CH (J2.43), U_AFE3 (R50_4.2 R91_4.2 R129_4.1 R140_4.1)
Vref-: Thermostat_8CH (J2.38), U_AFE0 (R44_1.2 R130_1.1 R132_1.2 R152_1.1)
Vref-: Thermostat_8CH (J2.40), U_AFE1 (R44_2.2 R130_2.1 R132_2.2 R152_2.1)
Vref-: Thermostat_8CH (J2.42), U_AFE2 (R44_3.2 R130_3.1 R132_3.2 R152_3.1)
Vref-: Thermostat_8CH (J2.44), U_AFE3 (R44_4.2 R130_4.1 R132_4.2 R152_4.1)

## Assembly variants
Default: not fitted C102 C103 C160 C161 IC15 IC23 IC36 IC39 IC40 IC41 J4 R44_1 R44_2 R44_3 R44_4 R50_1 R50_2 R50_3 R50_4 R91_1 R91_2 R91_3 R91_4 R126_1 R126_2 R126_3 R126_4 R127_1 R127_2 R127_3 R127_4 R129_1 R129_2 R129_3 R129_4 R130_1 R130_2 R130_3 R130_4 R132_1 R132_2 R132_3 R132_4 R221 R227 R229 R231 R232 R233 W2